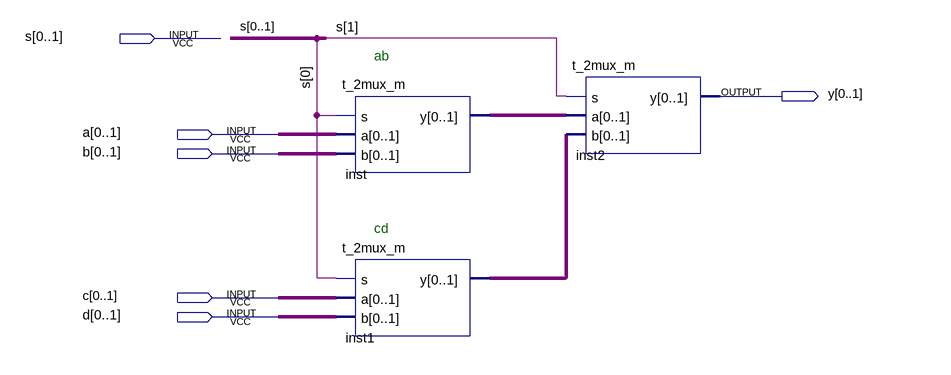
[diagram p0: schematic sheet]
// Quartus schematic t_4mux_2m.bdf as structural Verilog: 3 symbols, 6 pins
module t_4mux_2m (
  input  [0:1] s,
  input  [0:1] a,
  input  [0:1] b,
  input  [0:1] c,
  input  [0:1] d,
  output [0:1] y
);

  wire [1:0] inst1_y, inst_y;

  t_2mux_m inst (.s(s[0]), .a(a), .b(b), .y(inst_y));
  t_2mux_m inst1 (.s(s[0]), .a(c), .b(d), .y(inst1_y));
  t_2mux_m inst2 (.s(s[1]), .a(inst_y), .b(inst1_y), .y(y));

  // Notes on the sheet:
  //   ab
  //   cd
endmodule
